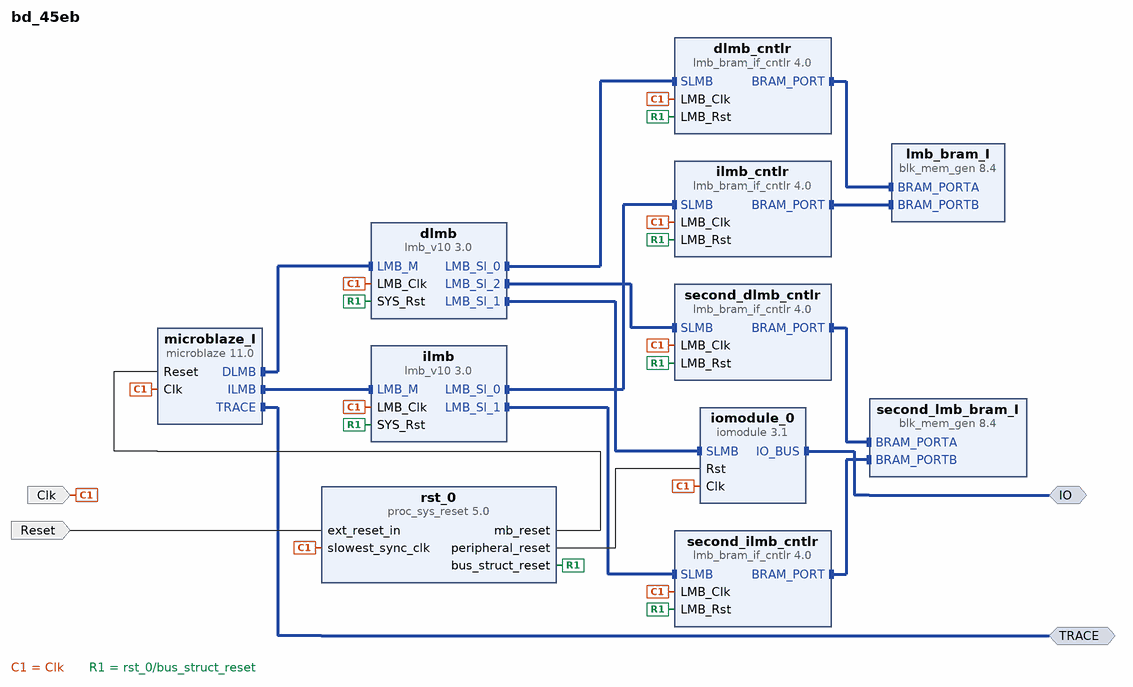
[diagram p0: block diagram of the top level]
# Vivado block design bd_45eb, xczu28dr-ffvg1517-2-e, Vivado 2019.1
create_bd_design bd_45eb

create_bd_intf_port -mode Master -vlnv xilinx.com:interface:mcsio_bus_rtl:1.0 IO
create_bd_intf_port -mode Master -vlnv xilinx.com:interface:mbtrace_rtl:2.0 TRACE
create_bd_port -dir I -type clk Clk
set_property -dict {CONFIG.ASSOCIATED_ASYNC_RESET Reset CONFIG.FREQ_HZ 100000000} [get_bd_ports Clk]
create_bd_port -dir I -type rst Reset
set_property -dict {CONFIG.POLARITY ACTIVE_HIGH} [get_bd_ports Reset]

create_bd_cell -type ip -vlnv xilinx.com:ip:microblaze:11.0 microblaze_I
set_property -dict [list \
  CONFIG.C_ASYNC_WAKEUP 3 \
  CONFIG.C_DEBUG_ENABLED 0 \
  CONFIG.C_FAULT_TOLERANT 0 \
  CONFIG.C_INSTANCE mb_microblaze_0 \
  CONFIG.C_PC_WIDTH 17 \
  CONFIG.C_TRACE 1 \
  CONFIG.C_USE_BARREL 1 \
  CONFIG.C_USE_DIV 1 \
  CONFIG.C_USE_EXT_BRK 0 \
  CONFIG.C_USE_EXT_NM_BRK 0 \
  CONFIG.C_USE_HW_MUL 1 \
  CONFIG.C_USE_PCMP_INSTR 1 \
  CONFIG.C_USE_REORDER_INSTR 0 \
] [get_bd_cells microblaze_I]
create_bd_cell -type ip -vlnv xilinx.com:ip:proc_sys_reset:5.0 rst_0
create_bd_cell -type ip -vlnv xilinx.com:ip:lmb_v10:3.0 ilmb
set_property -dict {CONFIG.C_LMB_NUM_SLAVES 2} [get_bd_cells ilmb]
create_bd_cell -type ip -vlnv xilinx.com:ip:lmb_v10:3.0 dlmb
set_property -dict {CONFIG.C_LMB_NUM_SLAVES 3} [get_bd_cells dlmb]
create_bd_cell -type ip -vlnv xilinx.com:ip:lmb_bram_if_cntlr:4.0 dlmb_cntlr
set_property -dict [list \
  CONFIG.C_BASEADDR 0x0000000000000000 \
  CONFIG.C_HIGHADDR 0x000000000000FFFF \
  CONFIG.C_MASK 0x00000000C0010000 \
] [get_bd_cells dlmb_cntlr]
create_bd_cell -type ip -vlnv xilinx.com:ip:lmb_bram_if_cntlr:4.0 ilmb_cntlr
set_property -dict [list \
  CONFIG.C_BASEADDR 0x0000000000000000 \
  CONFIG.C_HIGHADDR 0x000000000000FFFF \
  CONFIG.C_MASK 0x0000000080010000 \
] [get_bd_cells ilmb_cntlr]
create_bd_cell -type ip -vlnv xilinx.com:ip:blk_mem_gen:8.4 lmb_bram_I
set_property -dict {CONFIG.Memory_Type True_Dual_Port_RAM} [get_bd_cells lmb_bram_I]
create_bd_cell -type ip -vlnv xilinx.com:ip:lmb_bram_if_cntlr:4.0 second_dlmb_cntlr
set_property -dict [list \
  CONFIG.C_BASEADDR 0x0000000000010000 \
  CONFIG.C_HIGHADDR 0x0000000000017FFF \
  CONFIG.C_MASK 0x00000000C0010000 \
] [get_bd_cells second_dlmb_cntlr]
create_bd_cell -type ip -vlnv xilinx.com:ip:lmb_bram_if_cntlr:4.0 second_ilmb_cntlr
set_property -dict [list \
  CONFIG.C_BASEADDR 0x0000000000010000 \
  CONFIG.C_HIGHADDR 0x0000000000017FFF \
  CONFIG.C_MASK 0x0000000080010000 \
] [get_bd_cells second_ilmb_cntlr]
create_bd_cell -type ip -vlnv xilinx.com:ip:blk_mem_gen:8.4 second_lmb_bram_I
set_property -dict {CONFIG.Memory_Type True_Dual_Port_RAM} [get_bd_cells second_lmb_bram_I]
create_bd_cell -type ip -vlnv xilinx.com:ip:iomodule:3.1 iomodule_0
set_property -dict [list \
  CONFIG.C_BASEADDR 0x0000000080000000 \
  CONFIG.C_HIGHADDR 0x000000008000FFFF \
  CONFIG.C_INSTANCE iomodule \
  CONFIG.C_INTC_ADDR_WIDTH 17 \
  CONFIG.C_INTC_HAS_FAST 1 \
  CONFIG.C_INTC_USE_IRQ_OUT 1 \
  CONFIG.C_IO_BASEADDR 0x00000000C0000000 \
  CONFIG.C_IO_HIGHADDR 0x00000000FFFFFFFF \
  CONFIG.C_IO_MASK 0x00000000C0000000 \
  CONFIG.C_MASK 0x00000000C0000000 \
  CONFIG.C_USE_IO_BUS 1 \
] [get_bd_cells iomodule_0]

# ---- connections ----

connect_bd_intf_net [get_bd_intf_pins microblaze_I/ILMB] [get_bd_intf_pins ilmb/LMB_M]
connect_bd_intf_net -intf_net ilmb_sl_1 [get_bd_intf_pins ilmb/LMB_Sl_1] [get_bd_intf_pins second_ilmb_cntlr/SLMB]
connect_bd_intf_net -intf_net dlmb_sl_1 [get_bd_intf_pins dlmb/LMB_Sl_1] [get_bd_intf_pins iomodule_0/SLMB]
connect_bd_intf_net -intf_net dlmb_port_2 [get_bd_intf_pins second_dlmb_cntlr/BRAM_PORT] [get_bd_intf_pins second_lmb_bram_I/BRAM_PORTA]
connect_bd_intf_net -intf_net ilmb_port_2 [get_bd_intf_pins second_ilmb_cntlr/BRAM_PORT] [get_bd_intf_pins second_lmb_bram_I/BRAM_PORTB]
connect_bd_intf_net -intf_net dlmb_port [get_bd_intf_pins dlmb_cntlr/BRAM_PORT] [get_bd_intf_pins lmb_bram_I/BRAM_PORTA]
connect_bd_intf_net -intf_net dlmb_sl_0 [get_bd_intf_pins dlmb/LMB_Sl_0] [get_bd_intf_pins dlmb_cntlr/SLMB]
connect_bd_intf_net [get_bd_intf_ports TRACE] [get_bd_intf_pins microblaze_I/TRACE]
connect_bd_intf_net [get_bd_intf_pins microblaze_I/DLMB] [get_bd_intf_pins dlmb/LMB_M]
connect_bd_intf_net -intf_net ilmb_port [get_bd_intf_pins ilmb_cntlr/BRAM_PORT] [get_bd_intf_pins lmb_bram_I/BRAM_PORTB]
connect_bd_intf_net -intf_net ilmb_sl_0 [get_bd_intf_pins ilmb/LMB_Sl_0] [get_bd_intf_pins ilmb_cntlr/SLMB]
connect_bd_intf_net -intf_net iomodule_0_IO [get_bd_intf_ports IO] [get_bd_intf_pins iomodule_0/IO_BUS]
connect_bd_intf_net -intf_net dlmb_sl_2 [get_bd_intf_pins dlmb/LMB_Sl_2] [get_bd_intf_pins second_dlmb_cntlr/SLMB]
connect_bd_net [get_bd_ports Clk] \
  [get_bd_pins microblaze_I/Clk] [get_bd_pins ilmb/LMB_Clk] [get_bd_pins dlmb/LMB_Clk] [get_bd_pins dlmb_cntlr/LMB_Clk] \
  [get_bd_pins ilmb_cntlr/LMB_Clk] [get_bd_pins second_dlmb_cntlr/LMB_Clk] [get_bd_pins second_ilmb_cntlr/LMB_Clk] \
  [get_bd_pins iomodule_0/Clk] [get_bd_pins rst_0/slowest_sync_clk]
connect_bd_net [get_bd_ports Reset] [get_bd_pins rst_0/ext_reset_in]
connect_bd_net -net MB_Reset [get_bd_pins rst_0/mb_reset] [get_bd_pins microblaze_I/Reset]
connect_bd_net -net LMB_Rst2 [get_bd_pins rst_0/bus_struct_reset] \
  [get_bd_pins ilmb/SYS_Rst] [get_bd_pins dlmb/SYS_Rst] [get_bd_pins ilmb_cntlr/LMB_Rst] [get_bd_pins dlmb_cntlr/LMB_Rst] \
  [get_bd_pins second_ilmb_cntlr/LMB_Rst] [get_bd_pins second_dlmb_cntlr/LMB_Rst]
connect_bd_net -net IO_Rst [get_bd_pins rst_0/peripheral_reset] [get_bd_pins iomodule_0/Rst]
set_property HDL_ATTRIBUTE.BMM_INFO_PROCESSOR {microblaze-le > bd_45eb dlmb_cntlr} [get_bd_cells microblaze_I]
set_property HDL_ATTRIBUTE.KEEP_HIERARCHY yes [get_bd_cells microblaze_I]
set_property HDL_ATTRIBUTE.BMM_INFO_ADDRESS_SPACE {byte  0x00000000 32 >  bd_45eb lmb_bram_I bd_45eb second_lmb_bram_I} [get_bd_cells dlmb_cntlr]
set_property HDL_ATTRIBUTE.KEEP_HIERARCHY yes [get_bd_cells dlmb_cntlr]
set_property HDL_ATTRIBUTE.BMM_INFO_ADDRESS_RANGE { } [get_bd_cells second_dlmb_cntlr]

# ---- address map ----
assign_bd_address -offset 0x00000000 -range 64K -target_address_space [get_bd_addr_spaces microblaze_I/Data] [get_bd_addr_segs dlmb_cntlr/SLMB/Mem]
assign_bd_address -offset 0x00010000 -range 32K -target_address_space [get_bd_addr_spaces microblaze_I/Data] [get_bd_addr_segs second_dlmb_cntlr/SLMB/Mem]
assign_bd_address -offset 0x80000000 -range 64K -target_address_space [get_bd_addr_spaces microblaze_I/Data] [get_bd_addr_segs iomodule_0/SLMB/Reg]
assign_bd_address -offset 0xC0000000 -range 1G -target_address_space [get_bd_addr_spaces microblaze_I/Data] [get_bd_addr_segs iomodule_0/SLMB/IO]
assign_bd_address -offset 0x00000000 -range 64K -target_address_space [get_bd_addr_spaces microblaze_I/Instruction] [get_bd_addr_segs ilmb_cntlr/SLMB/Mem]
assign_bd_address -offset 0x00010000 -range 32K -target_address_space [get_bd_addr_spaces microblaze_I/Instruction] [get_bd_addr_segs second_ilmb_cntlr/SLMB/Mem]

validate_bd_design
save_bd_design
